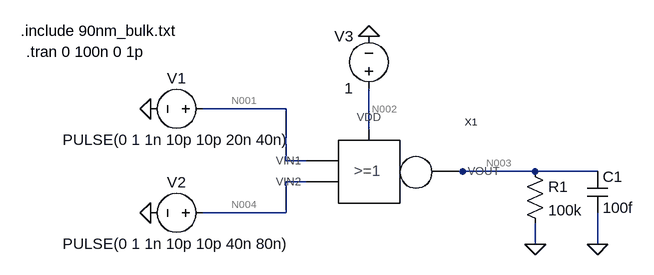
[diagram p0: schematic testingnor.asc]
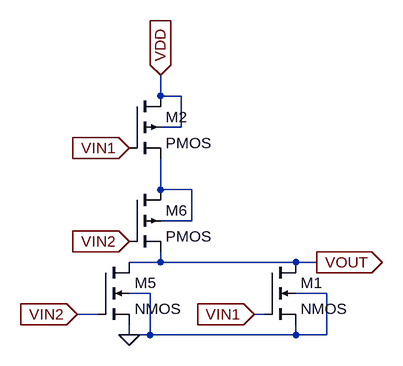
[diagram p1: sub-circuit dimanor.asc]
testingnor.asc, the LTspice schematic file:
Version 4
SHEET 1 880 680
WIRE 144 64 16 64
WIRE 272 96 272 32
WIRE 144 144 144 64
WIRE 176 144 144 144
WIRE 416 160 400 160
WIRE 528 160 416 160
WIRE 624 160 528 160
WIRE 176 176 144 176
WIRE 144 224 144 176
WIRE 144 224 16 224
WIRE 528 272 528 240
WIRE 624 272 624 224
FLAG 272 -48 0
FLAG -64 64 0
FLAG -64 224 0
FLAG 528 272 0
FLAG 624 272 0
SYMBOL voltage 32 64 R90
WINDOW 0 -32 56 VBottom 2
WINDOW 3 32 56 VTop 2
WINDOW 123 0 0 Left 0
WINDOW 39 0 0 Left 0
SYMATTR InstName V1
SYMATTR Value PULSE(0 1 1n 10p 10p 20n 40n)
SYMBOL voltage 32 224 R90
WINDOW 0 -32 56 VBottom 2
WINDOW 3 32 56 VTop 2
WINDOW 123 0 0 Left 0
WINDOW 39 0 0 Left 0
SYMATTR InstName V2
SYMATTR Value PULSE(0 1 1n 10p 10p 40n 80n)
SYMBOL voltage 272 48 R180
WINDOW 0 24 96 Left 2
WINDOW 3 24 16 Left 2
WINDOW 123 0 0 Left 0
WINDOW 39 0 0 Left 0
SYMATTR InstName V3
SYMATTR Value 1
SYMBOL cap 608 160 R0
SYMATTR InstName C1
SYMATTR Value 100f
SYMBOL res 512 144 R0
SYMATTR InstName R1
SYMATTR Value 100k
SYMBOL dimanor 272 144 R0
SYMATTR InstName X1
TEXT -264 -56 Left 2 !.include 90nm_bulk.txt
TEXT -256 -24 Left 2 !.tran 0 100n 0 1p

dimanor.asc, the sub-circuit schematic file:
Version 4
SHEET 1 880 680
WIRE 464 64 464 32
WIRE 496 64 464 64
WIRE 496 112 496 64
WIRE 496 112 464 112
WIRE 464 208 464 160
WIRE 512 208 464 208
WIRE 512 256 512 208
WIRE 512 256 464 256
WIRE 464 320 464 304
WIRE 464 320 416 320
WIRE 672 320 464 320
WIRE 704 320 672 320
WIRE 448 368 416 368
WIRE 720 368 672 368
WIRE 368 400 336 400
WIRE 624 400 608 400
WIRE 416 432 416 416
WIRE 448 432 448 368
WIRE 448 432 416 432
WIRE 672 432 672 416
WIRE 672 432 448 432
WIRE 720 432 720 368
WIRE 720 432 672 432
FLAG 416 144 VIN1
IOPIN 416 144 In
FLAG 416 288 VIN2
IOPIN 416 288 In
FLAG 608 400 VIN1
IOPIN 608 400 In
FLAG 336 400 VIN2
IOPIN 336 400 In
FLAG 416 432 0
FLAG 464 32 VDD
IOPIN 464 32 In
FLAG 704 320 VOUT
IOPIN 704 320 Out
SYMBOL nmos4 368 320 R0
SYMATTR InstName M5
SYMATTR Value2 l=90n w=200n
SYMBOL nmos4 624 320 R0
SYMATTR InstName M1
SYMATTR Value2 l=90n w=200n
SYMBOL pmos4 416 64 R0
SYMATTR InstName M2
SYMATTR Value2 l=90n w=400n
SYMBOL pmos4 416 208 R0
SYMATTR InstName M6
SYMATTR Value2 l=90n w=400n

The netlist it stands for:
* testingnor.asc
V1 N001 0 PULSE(0 1 1n 10p 10p 20n 40n)
V2 N004 0 PULSE(0 1 1n 10p 10p 40n 80n)
V3 N002 0 1
C1 N003 0 100f
R1 N003 0 100k
XX1 N001 N004 N002 N003 dimanor

* block symbol definitions
.subckt dimanor VIN1 VIN2 VDD VOUT
M5 VOUT VIN2 0 0 NMOS l=90n w=200n
M1 VOUT VIN1 0 0 NMOS l=90n w=200n
M2 VDD VIN1 N001 VDD PMOS l=90n w=400n
M6 N001 VIN2 VOUT N001 PMOS l=90n w=400n
.ends dimanor

.model NMOS NMOS
.model PMOS PMOS
.lib standard.mos
.include 90nm_bulk.txt
.tran 0 100n 0 1p
.backanno
.end

* Results of the author's LTspice run, read from the files saved beside the schematic
* Operating Point, zero values left out:
*   V(n002) = 1 V
*   V(n003) = 945.9 mV
*   I(R1) = 9.459 µA
*   I(V3) = -9.468 µA
*   I(V2) = 93.3 pA
*   I(V1) = 93.66 pA
*   Ix(x1:VIN1) = -93.66 pA
*   Ix(x1:VIN2) = -93.3 pA
*   Ix(x1:VDD) = 9.468 µA
*   Ix(x1:VOUT) = -9.459 µA
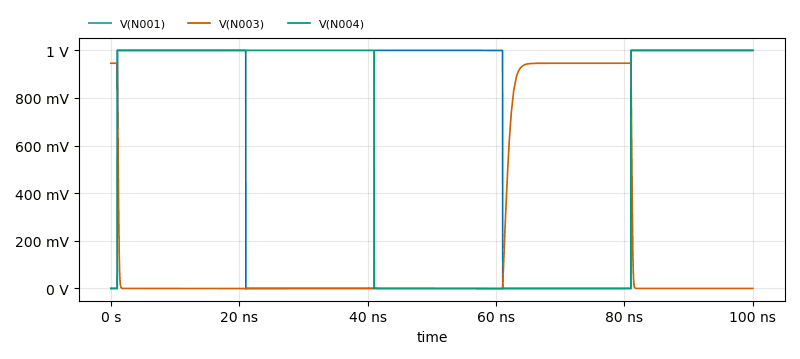
[diagram p2: Transient Analysis of testingnor.asc, plotted from the saved traces]
* Transient Analysis, 1 run:
*   V(N001): min 0 V, max 1 V, average 590.1 mV, rms 768.2 mV, last 1 V
*   V(N003): min -1.533 mV, max 948.4 mV, average 193.4 mV, rms 422.3 mV, last 1.148 µV
*   V(N004): min 0 V, max 1 V, average 590 mV, rms 768.1 mV, last 1 V